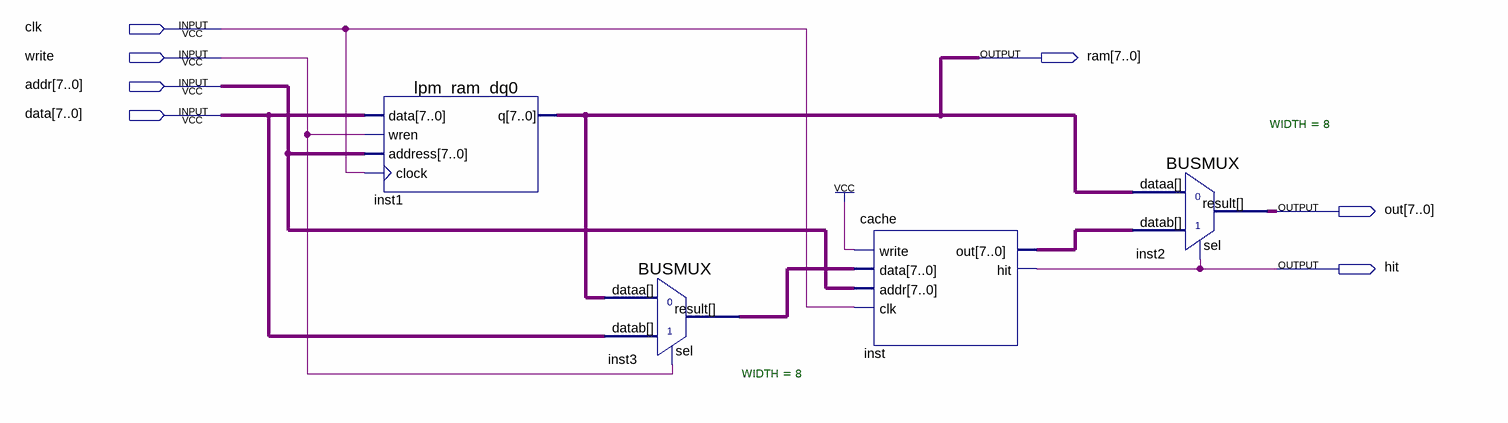
[diagram p0: schematic sheet]
// Quartus schematic cachetest.bdf as structural Verilog: 4 symbols, 7 pins
module cachetest (
  input  clk,
  input  write,
  input  [7:0] addr,
  input  [7:0] data,
  output [7:0] ram,
  output [7:0] out,
  output hit
);

  wire [7:0] inst3_result, inst_out;

  lpm_ram_dq0 inst1 (.data(data), .wren(write), .address(addr), .clock(clk), .q(ram));
  BUSMUX #(.WIDTH(8)) inst3 (.datab(data), .sel(write), .dataa(ram), .result(inst3_result));
  cache inst (.write(1'b1), .data(inst3_result), .addr(addr), .clk(clk), .out(inst_out), .hit(hit));
  BUSMUX #(.WIDTH(8)) inst2 (.datab(inst_out), .sel(hit), .dataa(ram), .result(out));
endmodule
